# Altium project PCB_local_github.PrjPcb
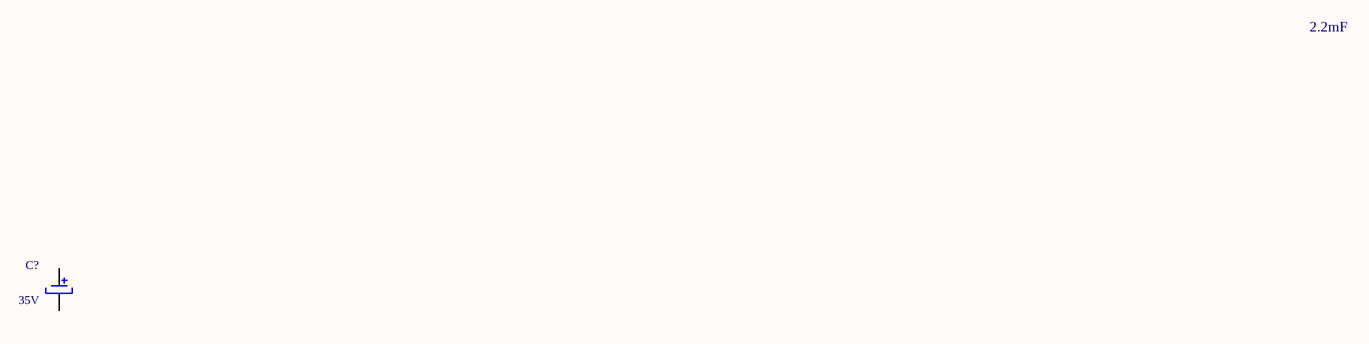
[diagram p0: Sheet1.SchDoc]
CAGE_CODE: ?????; CONTRACT_NUMBER: <CONTRACT NO>; DOC_NO_ASSY_DWG: <ASSY DWG NO>; DOC_NO_BOM: <BOM DOC NO>; DOC_NO_FAB_DWG: <FAB DWG NO>; DOC_NO_SCH_DWG: <SCH DWG NO>; PCB_2_DEC_TOL: +/-.01; PCB_3_DEC_TOL: +/-.010; PCB_ANG_TOL: +/-1/2; PCB_ASSEMBLY_NO: <PCB ASSY NO>; PCB_CHECKER: - -----; PCB_CHECKER_APP_DATE: --/--/----; PCB_DESIGNER: - -----; PCB_DESIGNER_APP_DATE: --/--/----; PCB_DWG_NO: <PCB DWG NO>; PCB_ENGINEER: - -----; PCB_ENGINEER_APP_DATE: --/--/----; PCB_PART_NUMBER: <PCB PN>; PCB_REV: A; SCH_REV: A
1 sheet, 1 parts. Net scope: global (net labels, ports and power ports of the same name join across sheets).
Board file: PCB1.PcbDoc

## Sheet Sheet1.SchDoc
size 431 x 279 mm; SheetNumber: 1; SheetTotal: 1; ENG_APP_DATE: --/--/--; DSN_APP_DATE: --/--/--; CHK_APP_DATE: --/--/--

### Parts
C?  value 2.2mF  Rated Voltage: 35V  [alum16_t2_d1650_0_h2700_G]  (hidden comment: 609837000A)

### Nets

Not connected (* = marked no-connect by the designer): C? 1(p) 2(m)

### Notes on the sheet
- DWG. NO.
- REV.
- SHT.
- THIS DOCUMENT AND THE DATA DISCLOSED HEREIN OR HEREWITH IS THE PROPERTY OF ALTIUM LIMITED AND MAY BE FREELY DISTRIBUTED IN WHOLE. NO RIGHTS ARE RESERVED OR EXPRESS OR IMPLIED WARANTEE GIVEN.
- REVISION
- DESCRIPTION
- DATE
- APPROVED
- ENG:
- APPROVALS
- PROJECT
- DSN:
- CHK:
- REFERENCE DOCUMENTS
- PROJECT REVISION:
- TITLE
- DOCUMENT REVISION:
- DESIGN ITEM:
- BOM:
- FAB DWG:
- PCB DWG:
- ASSY DWG:
- SCALE:
- SIZE
- B
- CAGE CODE
- FILE NAME
- DWG NO.
- SHEET
- OF
- REV

### Library data of the parts
C? = CMP-001-00246-1: CAPACITOR, ALUMINUM, 2.2 MF, 20 PERCENTAGE , 35.0 V, THD, D:16, (LF), (A), P1; Tolerance: 0.2%; Ripple Current: 1.11A; Authority: 105218 AHO GPM EL CO; Automotive Grade: YES; Cap Lead Diameter: 0mm; Commodity Code: EL; Created By ECR: 214849; Currency: USD; ESR: 0; Max Op. Temp: 105C; Min Op. Temp: -55C; PLM State: Release; Preferred Usage: Green; Volume: 1200; Case/Package: D:16; Part Number: 609837000A; Catalog Group: Capacitor; Cost: 0.3908; Footprint Top: alum16_t2_d1650_0_h2700_G; Lead Free: YES; Lifecycle Level: Production; Part Type: ALUMINUM; Status: D